# Altium schematic sheet ife19_TS_AIL.SchDoc
size A4
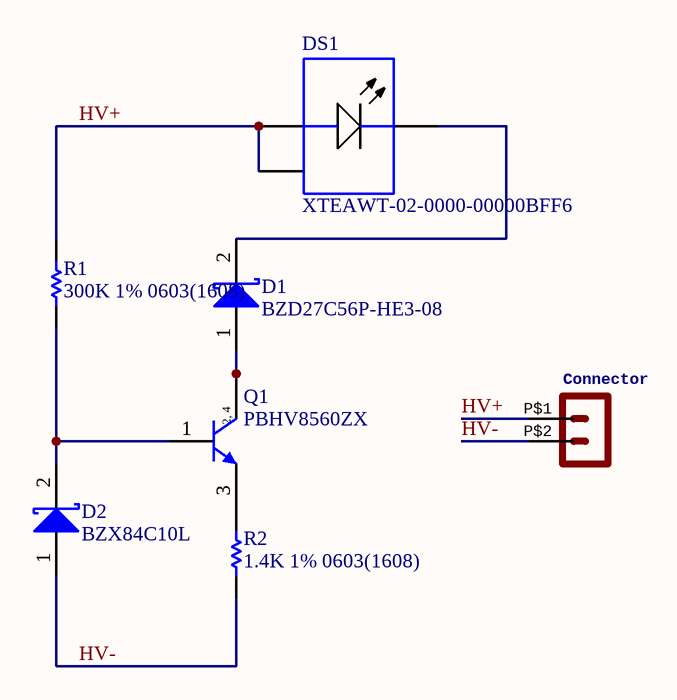
[diagram p0: ife19_TS_AIL.SchDoc]

## Parts
Connector  (no value)  [43650-0224]
D1  BZD27C56P-HE3-08  [VISH-DO-219AB_V]
D2  BZX84C10L  [VISH-DO-219AB_V]
DS1  XTEAWT-02-0000-00000BFF6  [CREE-XT-E_LED-3_A_V]
Q1  PBHV8560ZX  [NXP-SOT223_L]
R1  300K 1% 0603(1608)  [RESC0603(1608)_L]
R2  1.4K 1% 0603(1608)  [RESC0603(1608)_L]

## Nets
HV+: Connector.P$1 DS1.1(A) DS1.3(EP) R1.2
HV-: Connector.P$2 D2.1(A) R2.1
NetD1_1: D1.1(A) Q1.2(C) Q1.4(C)
NetD1_2: D1.2(K) DS1.2(K)
NetD2_2: D2.2(K) Q1.1(B) R1.1
NetQ1_3: Q1.3(E) R2.2

## Notes on the sheet
- (in symbol CMP-2000-05940-1) 2, 4

## Library data of the parts
Connector = HEADER_POS2_?43650-0224: GateName_1: G$1; SymbolName_1: HEADER_POS2; DeviceName: 43650-0224; LibraryName: MOLEX Micro-Fit; DeviceSetName: HEADER_POS2_?; Package: 43650-0224
D1 D2 = CMP-1711-00001-1: Schottky Rectifier, 30 V, 1.1 A, 2-Pin DO-219AB (SMF), RoHS, Tape and Reel; PartNumber: SL03-GS08CT; Manufacturer: Vishay Semiconductor; ComponentLink1URL: http://www.vishay.com/; DatasheetVersion: Rev. 2.0; Mounting Technology: Surface Mount; ComponentLink2URL: http://www.vishay.com/docs/85687/sl02.pdf; PackageReference: DO-219AB; ComponentLink1Description: Manufacturer URL; PackageDescription: 2-Pin Small Outline Diode, Flat Lead, Body 1.90 x 2.9 mm; ComponentLink2Description: Datasheet
DS1 = CMP-2000-05092-1: XLamp(R) XT-E LED, 350 mA, 2.85 V, 3-Pin SMD, RoHS, Tape and Reel; Manufacturer: Cree; Current - Test: 350mA; Flux @ 85 degC, Current - Test: 126lm(122lm~130lm); Color: White,Warm; Viewing Angle: 115deg; Design Resources: LightingProductSelector; Current - Max: 1.5A; Featured Product: XLampHorticultureLighting; Voltage - Forward (Vf) (Typ): 2.85V; CCT (K): 3750K; CRI (Color Rendering Index): 70; Thermal Resistance of Package: 5degC/W; Associated Product: 711-1181-ND-LEDREFLECTOR711-1179-ND-LEDREFLECTORC13253_TINA2-R-CLIP16-ND-REFLECTORROUND1POS16.1MMD1C13353_LEILA-R-CLIP16-ND-REFLECTORROUND1POS21.6MMD1C12516_RITA-WAS-ND-REFLECTORRECTANG1POS31.9+2FP13025_LISA2-W-PIN-ND-ASSEMBLYROUND1POS9.9MMD6.8FP13026_LISA2-WW-PIN-ND-ASSEMBLYROUND1POS9.9MMD6.8FP13028_LISA2-M-PIN-ND-ASSEMBLYROUND1POS9.9MMD6.8FP13029_LISA2-WW-CLIP-ND-ASSEMBLYROUND1POS9.9MMD6.8FP13030_LISA2-M-CLIP-ND-ASSEMBLYROUND1POS9.9MMD6.8FA13093_TINA-M2-ND-ASSEMBLYROUND1POS16.1MMD9.FCA13329_BILLIE-A-ND-ASSEMBLYROUND1POS21.5MMD16FN13888_BILLIE-A-ND-ASSEMBLYROUND1POS21.5MMD16C12480_MIRELLA-50-S-PIN-ND-REFLECTOR1POS49.9MMRND24MMC12481_MIRELLA-50-M-PIN-ND-REFLECTOR1POS49.9MMRND24MMC12482_MIRELLA-50-W-PIN-ND-REFLECTOR1POS49.9MMRND24MMCN12486_MIRELLA-50-S-PIN-DL-ND-REFLECTOR49.9MMRND24MMCN12487_MIRELLA-50-M-PIN-DL-ND; Lumens/Watt @ Current - Test: 126lm/W; Packaging: Tape&Reel(TR); Family: LEDLighting-White; Standard Package: 250; Series: XLampXT-E; Datasheet Version: Rev. 13D, 04/2016; Manufacturer URL: http://www.cree.com/; Mounting Type: SurfaceMount; Package / Case: 2-SMD,NoLead,ExposedPad; Datasheet URL: http://www.mouser.com/ds/2/90/XLampXTE-181295.pdf; Category: Optoelectronics; Flux @ 25 degC, Current - Test: -
Q1 = CMP-2000-05940-1: NPN Medium Power Transistor, 60 V, 1 A, -55 to 150 degC, 4-Pin SOT223, RoHS, Tape and Reel; Manufacturer: NXP Semiconductors; Vce Saturation (Max) @ Ib, Ic: 500mV@50mA,500mA; PCN Packaging: LighterReels02/Jan/2014; Online Catalog: NPNTransistors; Frequency - Transition: 180MHz; Voltage - Collector Emitter Breakdown (Max): 60V; Power - Max: 1.35W; Current - Collector Cutoff (Max): 100nA(ICBO); Current - Collector (Ic) (Max): 1A; Other Names: 568-8013-6; PCN Design/Specification: ResinHardener02/Jul/2013; Package Version: 06-03-16, 03/2006; DC Current Gain (hFE) (Min) @ Ic, Vce: 100@150mA,2V; Featured Product: NXP-I²CInterface; Manufacturer URL: http://www.nxp.com/; Packaging: Digi-Reel®; Mounting Technology: SurfaceMount; Package / Case: TO-261-4,TO-261AA; Standard Package: 1; Series: -; Datasheet URL: http://www.nxp.com/documents/data_sheet/BCP55_BCX55_BC55PA.pdf?fasp=1&WT_TYPE=Data%20Sheets&WT_VENDOR=FREESCALE&WT_FILE_FORMAT=pdf&WT_ASSET=Documentation&fileExt=.pdf; Package URL: http://www.nxp.com/documents/outline_drawing/SOT223.pdf; Package Description: 4-Pin Small Outline Transistor Package, Body 6.5 x 3.5 mm, Pitch 2.3 mm; Category: DiscreteSemiconductorProducts; Family: Transistors(BJT)-Single; Transistor Type: NPN; Datasheet Version: Rev. 8, 10/2011; Package Reference: SOT223; Supplier Device Package: SC-73; Mounting Type: SurfaceMount
R1 = CMP-1012-00779-1: 249K 0.1W 1% 0603 (1608 Metric)  SMD; Case-Metric: 1608; Case-EIA: 0603; Value: 249000.00 Ohm; Technology: SMT; Power: 0.1 W; Tolerance: 1 %
R2 = CMP-1012-00796-1: 348K 0.1W 1% 0603 (1608 Metric)  SMD; Value: 348000.00 Ohm; Case-Metric: 1608; Case-EIA: 0603; Tolerance: 1 %; Power: 0.1 W; Technology: SMT